# EAGLE design sd-adaptor-v.0.4 (EAGLE 7.4.0)
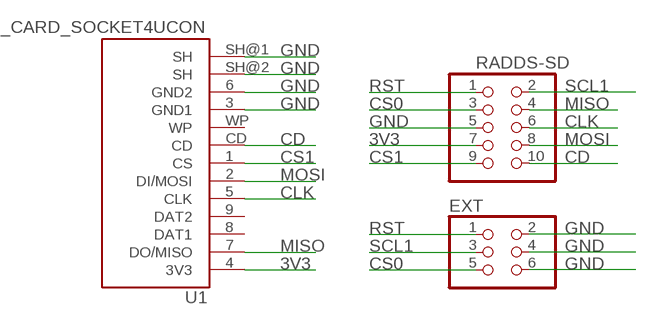
[diagram p0: schematic, sheet 1]

## Parts
EXT  PINHD-2X3_2.54-SMD  [2X03SMD]
RADDS-SD  PINHD-2X5_2.54-SMD  [2X05SMD]
U1  SD_CARD_SOCKET4UCON  [SDCARD_4UCONN]

## Nets
3V3: RADDS-SD.7 U1.4(3V3)
CD: RADDS-SD.10 U1.CD
CLK: RADDS-SD.6 U1.5(CLK)
CS0: EXT.5 RADDS-SD.3
CS1: RADDS-SD.9 U1.1(CS)
GND: EXT.2 EXT.4 EXT.6 RADDS-SD.5 U1.3(GND1) U1.6(GND2) U1.SH@1(SH) U1.SH@2(SH)
MISO: RADDS-SD.4 U1.7(DO/MISO)
MOSI: RADDS-SD.8 U1.2(DI/MOSI)
RST: EXT.1 RADDS-SD.1
SCL1: EXT.3 RADDS-SD.2
Unconnected: U1.8(DAT1) U1.9(DAT2) U1.WP

## Library data of the parts
EXT = pinhead-1:PINHD-2X3: PIN HEADER
RADDS-SD = pinhead-1:PINHD-2X5: PIN HEADER
U1 = SparkFun-Connectors:SD_CARD_SOCKET: SD Memory Card Connector, push-push normal type, CD enable, WP enable

## Net classes
0 default: width 0.254 mm

## Board
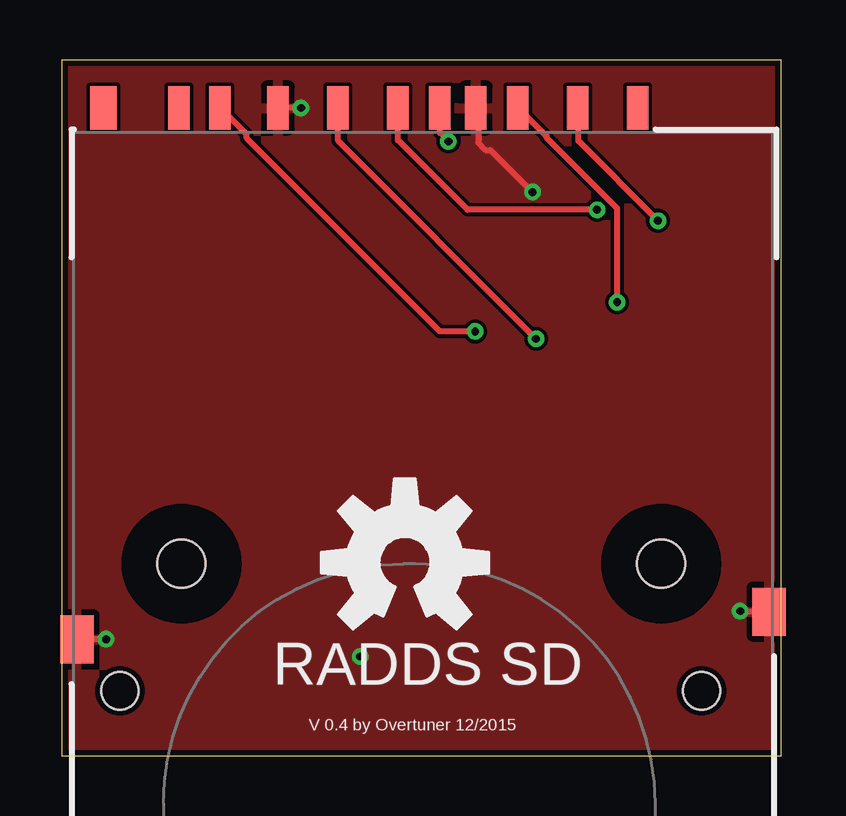
[diagram p1: board, top side]
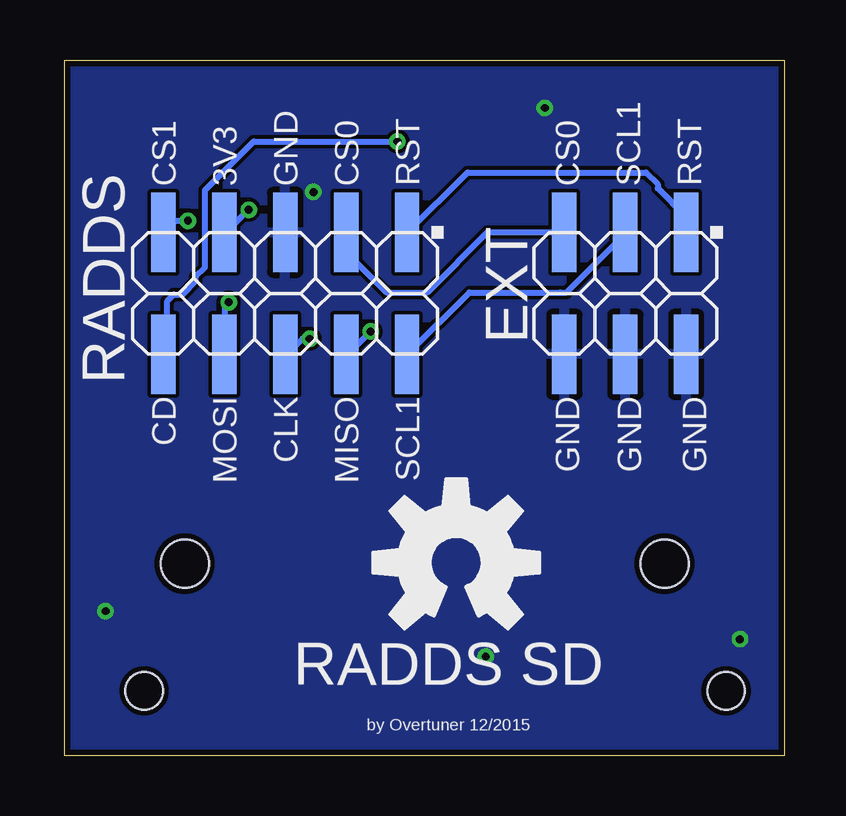
[diagram p2: board, bottom side, seen from below]

Size 30 x 29 mm. Coordinates in mm from the lower left corner, seen from the top.
Outline: 0,0 30,0 30,29 0,29 0,0
Copper layers (1*16): Top 0.0356mm / dielectric 1.5011mm / Bottom 0.0356mm
Design rules "LaenPCBOrder (2) *": minimum track width 6mil, minimum drill 13mil, track to track 6mil, track to pad 6mil, pad to pad 6mil, via to via 6mil, smd to smd 6mil, copper to edge 10mil, drill to drill 6mil, minimum pad ring 7mil, minimum via ring 7mil, stop-mask expansion 3mil, vias tented up to drill 13mil, thermal gap 10mil
Holes 2 mm at 5,8 25,8

### Footprints (pad centres in the part's own frame; a part is rotated, then mirrored left to right if it is on the bottom)
2X03SMD = smd 1.016 x 3.302: 1 -1.27,-3.81; 2 -1.27,1.27; 3 1.27,-3.81; 4 1.27,1.27; 5 3.81,-3.81; 6 3.81,1.27
2X05SMD = smd 1.016 x 3.302: 1 -1.27,-3.81; 2 -1.27,1.27; 3 1.27,-3.81; 4 1.27,1.27; 5 3.81,-3.81; 6 3.81,1.27; 7 6.35,-3.81; 8 6.35,1.27; 9 8.89,-3.81; 10 8.89,1.27
SDCARD_4UCONN = smd 1.8 x 0.9: 1 -1,6.77; 2 -1,4.27; 3 -1,2.52; 4 -1,-0.73; 5 -1,-3.23; 6 -1,-5.73; 7 -1,-8.15; 8 -1,-9.85; 9 -1,9.27; CD -1,1.02 | smd 2 x 1.4: SH@1 20,14.75; SH@2 21.15,-14.115 | smd 1.8 x 1.1: WP -1,-13 | hole 1.55: 23.3,11.94; 23.3,-12.32

### Placement (x,y rotation side)
EXT  5.37,18 180 bottom
RADDS-SD  17,18 180 bottom
U1  14.75,26 270 top
U$1  [OSHW-LOGO-L]  13.68,8.05 0 bottom
U$3  [OSHW-LOGO-L]  14.32,8.05 0 top

### Tracks (layer width: path | path; a pad name or v marks a point on that pad's centre or on a via)
3V3  (via drill 0.33)
  Top 0.254: v22.33,22.76 16.92,22.76 14.02,25.65 14.02,26.98 U1.4
  Bottom 0.254: v22.33,22.76 23.27,21.82 RADDS-SD.7
CD  (via drill 0.33)
  Top 0.254: v16.13,25.6 15.77,25.96 15.77,26.98 U1.CD
  Bottom 0.254: v16.13,25.6 22.12,25.6 24.16,23.57 24.16,20.34 24.54,19.96 24.54,19.79 25.09,19.23 25.45,19.23 25.73,18.95 25.73,16.89 RADDS-SD.10
CLK  (via drill 0.33)
  Top 0.254: v19.79,17.37 11.53,25.63 11.53,26.98 U1.5
  Bottom 0.254: v19.79,17.37 20.09,17.37 20.73,16.74 RADDS-SD.6
CS0
  Bottom 0.254: EXT.5 9.2,21.82 12.37,21.82 14.88,19.3 16.59,19.3 18.26,20.98 18.26,21.79 RADDS-SD.3
CS1  (via drill 0.33)
  Top 0.254: v24.87,22.3 21.54,25.63 21.54,26.98 U1.1
  Bottom 0.254: v24.87,22.3 25.38,22.3 25.88,21.79 RADDS-SD.9
GND  (via drill 0.33)
  Top 0.254: v9.98,27 9.04,27 U1.6 | v19.63,23.5 17.88,25.25 17.68,25.25 17.37,25.55 17.37,26.87 17.27,26.98 U1.3 | v1.85,4.85 U1.SH@2 | v28.3,6.02 29.49,6.02 U1.SH@1
  other vias: 12.45,4.12
  pour Bottom: 0,0 30,0 30,29 0,29
  pour Top: 0,0 30,0 30,29 0,29
MISO  (via drill 0.33)
  Top 0.254: v17.25,17.68 15.77,17.68 7.72,25.73 7.72,25.91 6.66,26.98 6.6,26.98 U1.7
  Bottom 0.254: v17.25,17.68 18.19,16.74 RADDS-SD.4
MOSI  (via drill 0.33)
  Top 0.254: v23.16,18.9 23.16,22.81 20.22,25.76 20.22,25.83 19.07,26.98 19.02,26.98 U1.2
  Bottom 0.254: v23.16,18.9 23.32,18.75 23.32,16.76 RADDS-SD.8
N$3
  cutout Top: 5,10.5 arc-90 7.5,8 arc-90 5,5.5 arc-90 2.5,8 arc-90
  cutout Top: 25,10.5 arc-90 27.5,8 arc-90 25,5.5 arc-90 22.5,8 arc-90
RST
  Bottom 0.254: EXT.1 4.12,21.82 4.12,22.48 5.28,23.65 5.28,23.82 5.77,24.31 13.21,24.31 15.72,21.79 RADDS-SD.1
SCL1
  Bottom 0.254: EXT.3 6.66,21.79 6.66,21.74 9.09,19.3 9.34,19.3 9.98,19.3 13.13,19.3 15.72,16.71 RADDS-SD.2

### Text on the board
tPlace: RADDS SD | V 0.4 by Overtuner 12/2015
bPlace: RST | SCL1 | CS0 | RST | CS0 | GND | 3V3 | CS1 | EXT | RADDS | GND | GND | GND | SCL1 | MISO | CLK | MOSI | CD | RADDS SD | by Overtuner 12/2015